# EasyEDA schematic SCH_Clock_2021-09-15.json
TITLE: Clock; REV: 1.0; Date: 2021-09-15; Sheet: 1/1; Drawn By: Ferrie Bank; Company: Oude Snepelaar
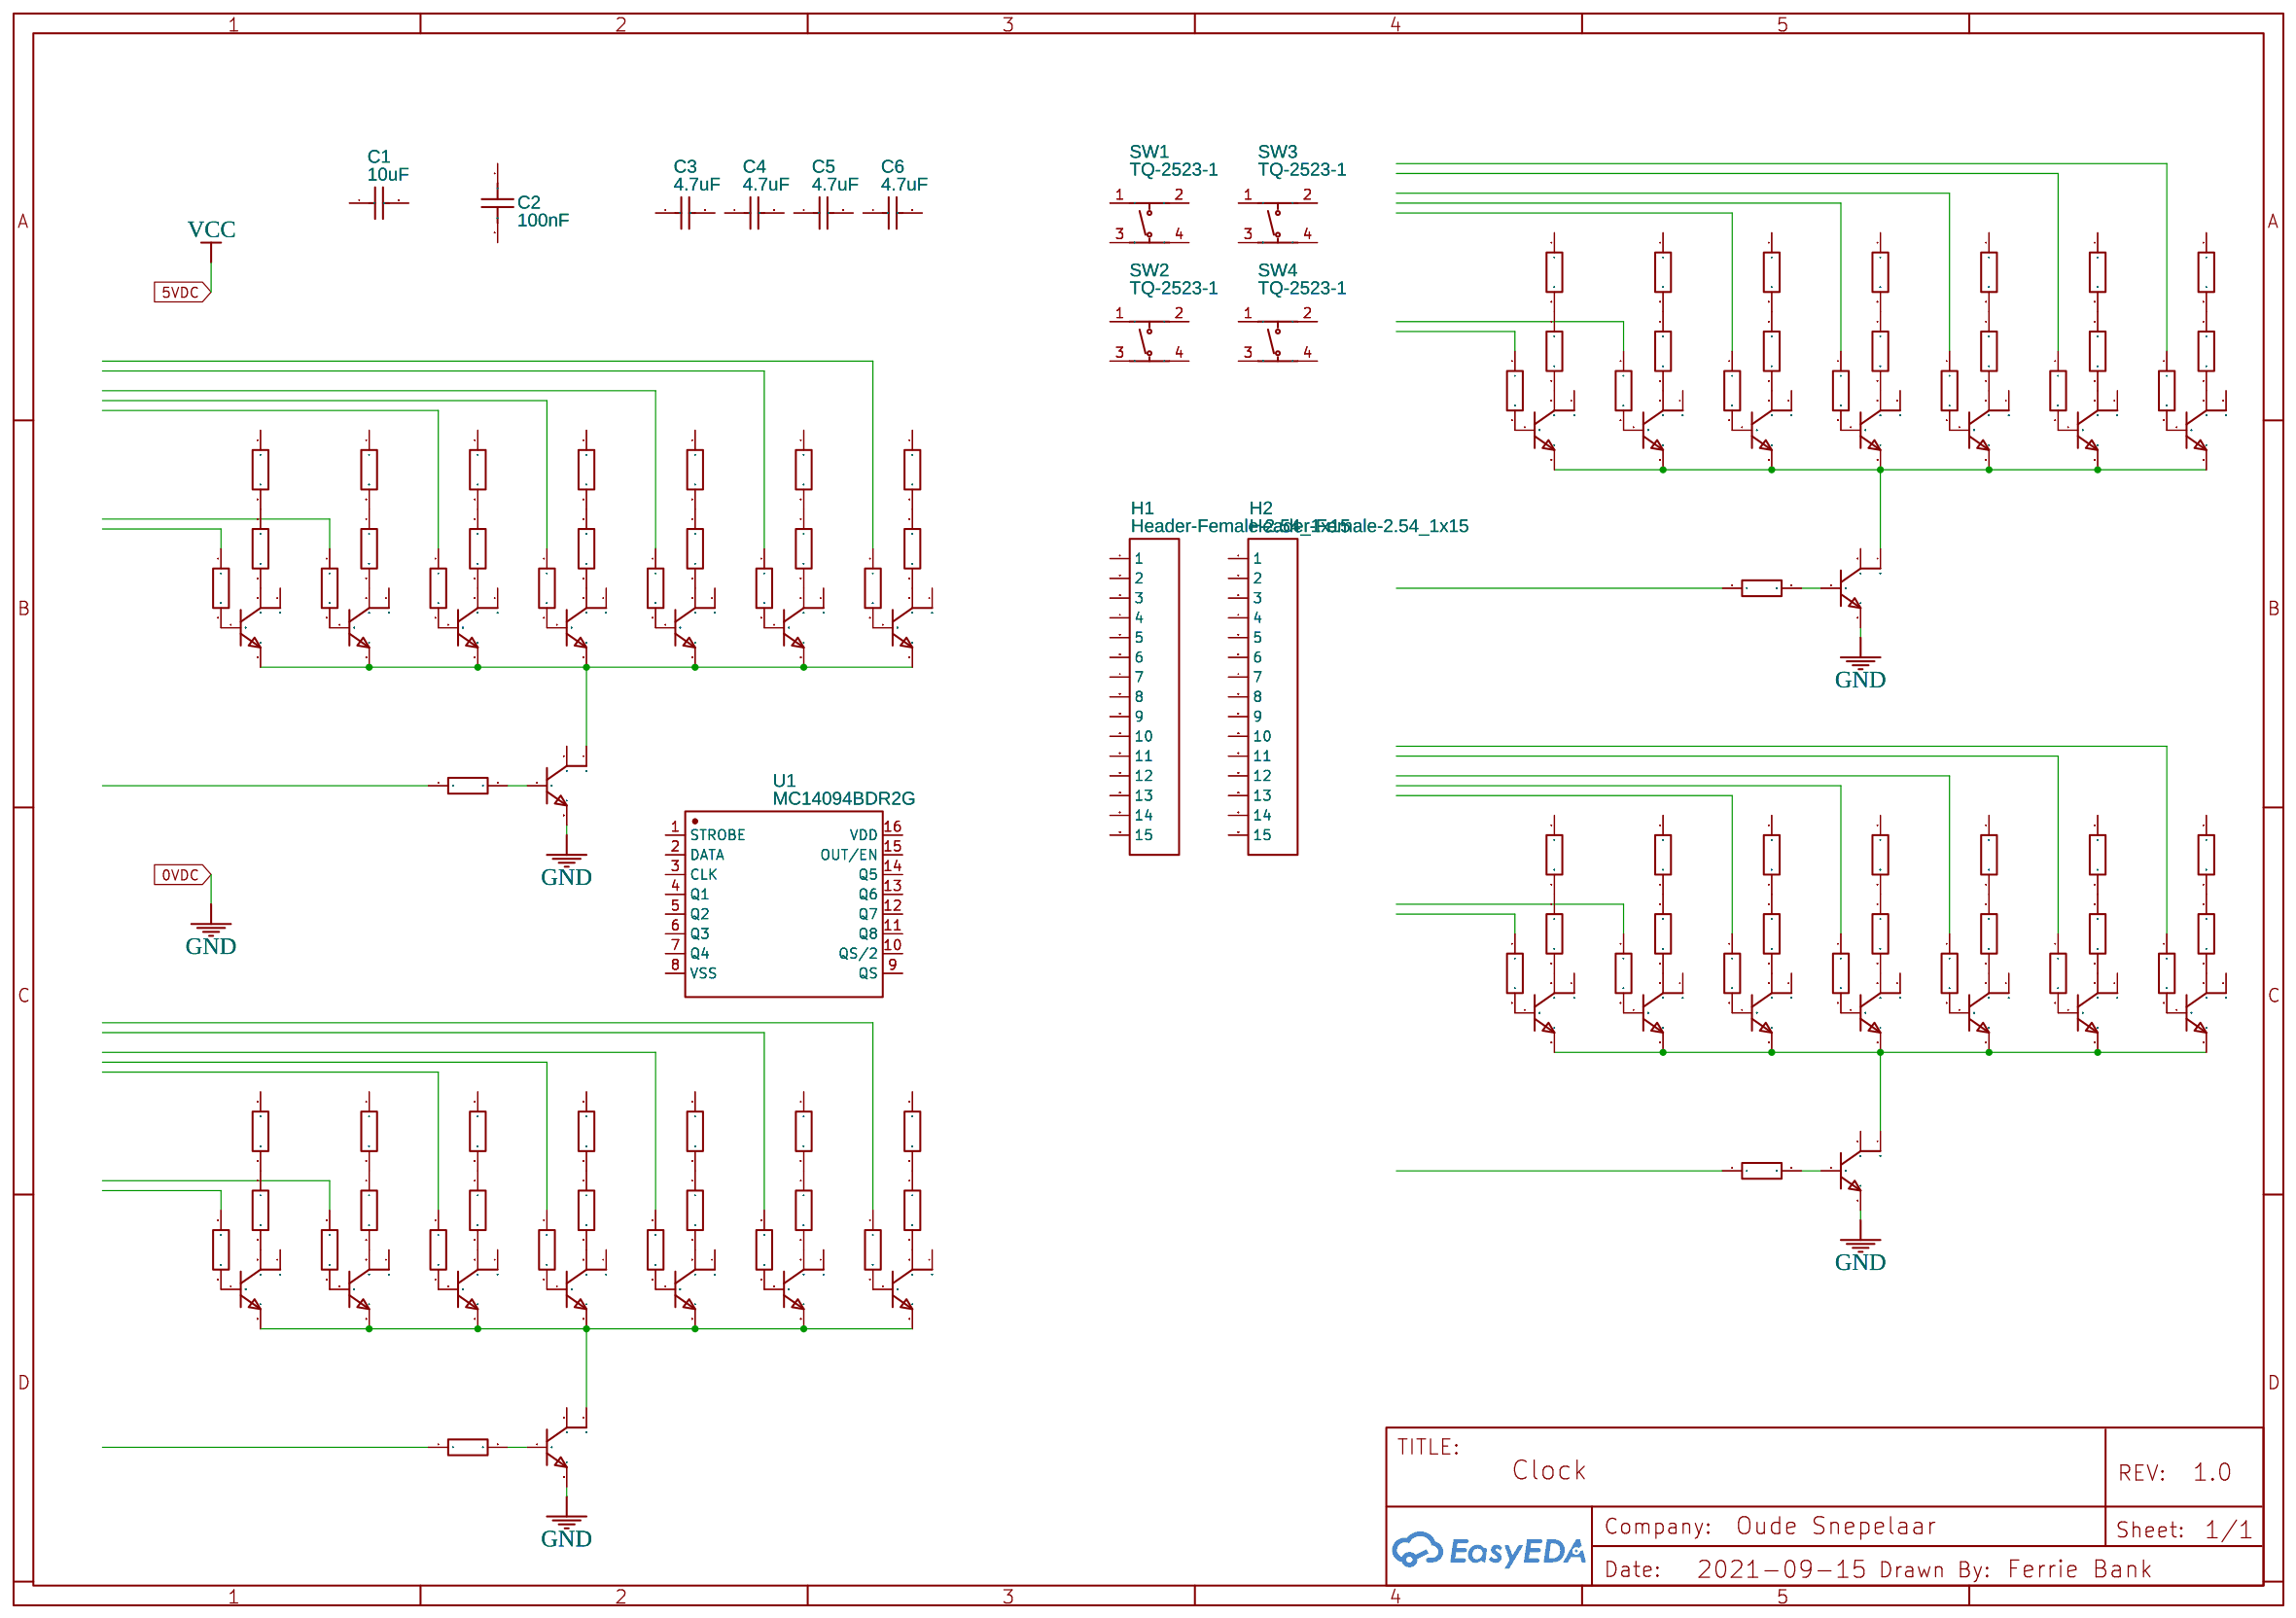
[diagram p0: schematic sheet]

## Parts
C1  10uF  [C0805]
C2  100nF  [C0603]
C3  4.7uF  [C1206]
C4  4.7uF  [C1206]
C5  4.7uF  [C1206]
C6  4.7uF  [C1206]
DGAQ1  PZT2222A  [SOT-223-3_L6.5-W3.4-P2.30-LS7.0-BR]
DGAQ2  PZT2222A  [SOT-223-3_L6.5-W3.4-P2.30-LS7.0-BR]
DGAQ3  PZT2222A  [SOT-223-3_L6.5-W3.4-P2.30-LS7.0-BR]
DGAQ4  PZT2222A  [SOT-223-3_L6.5-W3.4-P2.30-LS7.0-BR]
DGAQ5  PZT2222A  [SOT-223-3_L6.5-W3.4-P2.30-LS7.0-BR]
DGAQ6  PZT2222A  [SOT-223-3_L6.5-W3.4-P2.30-LS7.0-BR]
DGAQ7  PZT2222A  [SOT-223-3_L6.5-W3.4-P2.30-LS7.0-BR]
DGAQ8  PZT2222A  [SOT-223-3_L6.5-W3.4-P2.30-LS7.0-BR]
DGAR1  75  [R0603]
DGAR2  75  [R0603]
DGAR3  75  [R0603]
DGAR4  75  [R0603]
DGAR5  75  [R0603]
DGAR6  75  [R0603]
DGAR7  75  [R0603]
DGAR8  75  [R0603]
DGAR9  75  [R0603]
DGAR10  75  [R0603]
DGAR11  75  [R0603]
DGAR12  75  [R0603]
DGAR13  75  [R0603]
DGAR14  75  [R0603]
DGAR15  33  [R0603]
DGAR16  33  [R0603]
DGAR17  33  [R0603]
DGAR18  33  [R0603]
DGAR19  33  [R0603]
DGAR20  33  [R0603]
DGAR21  33  [R0603]
DGAR22  33  [R0603]
DGBQ1  PZT2222A  [SOT-223-3_L6.5-W3.4-P2.30-LS7.0-BR]
DGBQ2  PZT2222A  [SOT-223-3_L6.5-W3.4-P2.30-LS7.0-BR]
DGBQ3  PZT2222A  [SOT-223-3_L6.5-W3.4-P2.30-LS7.0-BR]
DGBQ4  PZT2222A  [SOT-223-3_L6.5-W3.4-P2.30-LS7.0-BR]
DGBQ5  PZT2222A  [SOT-223-3_L6.5-W3.4-P2.30-LS7.0-BR]
DGBQ6  PZT2222A  [SOT-223-3_L6.5-W3.4-P2.30-LS7.0-BR]
DGBQ7  PZT2222A  [SOT-223-3_L6.5-W3.4-P2.30-LS7.0-BR]
DGBQ8  PZT2222A  [SOT-223-3_L6.5-W3.4-P2.30-LS7.0-BR]
DGBR1  75  [R0603]
DGBR2  75  [R0603]
DGBR3  75  [R0603]
DGBR4  75  [R0603]
DGBR5  75  [R0603]
DGBR6  75  [R0603]
DGBR7  75  [R0603]
DGBR8  75  [R0603]
DGBR9  75  [R0603]
DGBR10  75  [R0603]
DGBR11  75  [R0603]
DGBR12  75  [R0603]
DGBR13  75  [R0603]
DGBR14  75  [R0603]
DGBR15  33  [R0603]
DGBR16  33  [R0603]
DGBR17  33  [R0603]
DGBR18  33  [R0603]
DGBR19  33  [R0603]
DGBR20  33  [R0603]
DGBR21  33  [R0603]
DGBR22  33  [R0603]
DGCQ1  PZT2222A  [SOT-223-3_L6.5-W3.4-P2.30-LS7.0-BR]
DGCQ2  PZT2222A  [SOT-223-3_L6.5-W3.4-P2.30-LS7.0-BR]
DGCQ3  PZT2222A  [SOT-223-3_L6.5-W3.4-P2.30-LS7.0-BR]
DGCQ4  PZT2222A  [SOT-223-3_L6.5-W3.4-P2.30-LS7.0-BR]
DGCQ5  PZT2222A  [SOT-223-3_L6.5-W3.4-P2.30-LS7.0-BR]
DGCQ6  PZT2222A  [SOT-223-3_L6.5-W3.4-P2.30-LS7.0-BR]
DGCQ7  PZT2222A  [SOT-223-3_L6.5-W3.4-P2.30-LS7.0-BR]
DGCQ8  PZT2222A  [SOT-223-3_L6.5-W3.4-P2.30-LS7.0-BR]
DGCR1  75  [R0603]
DGCR2  75  [R0603]
DGCR3  75  [R0603]
DGCR4  75  [R0603]
DGCR5  75  [R0603]
DGCR6  75  [R0603]
DGCR7  75  [R0603]
DGCR8  75  [R0603]
DGCR9  75  [R0603]
DGCR10  75  [R0603]
DGCR11  75  [R0603]
DGCR12  75  [R0603]
DGCR13  75  [R0603]
DGCR14  75  [R0603]
DGCR15  33  [R0603]
DGCR16  33  [R0603]
DGCR17  33  [R0603]
DGCR18  33  [R0603]
DGCR19  33  [R0603]
DGCR20  33  [R0603]
DGCR21  33  [R0603]
DGCR22  33  [R0603]
DGDQ1  PZT2222A  [SOT-223-3_L6.5-W3.4-P2.30-LS7.0-BR]
DGDQ2  PZT2222A  [SOT-223-3_L6.5-W3.4-P2.30-LS7.0-BR]
DGDQ3  PZT2222A  [SOT-223-3_L6.5-W3.4-P2.30-LS7.0-BR]
DGDQ4  PZT2222A  [SOT-223-3_L6.5-W3.4-P2.30-LS7.0-BR]
DGDQ5  PZT2222A  [SOT-223-3_L6.5-W3.4-P2.30-LS7.0-BR]
DGDQ6  PZT2222A  [SOT-223-3_L6.5-W3.4-P2.30-LS7.0-BR]
DGDQ7  PZT2222A  [SOT-223-3_L6.5-W3.4-P2.30-LS7.0-BR]
DGDQ8  PZT2222A  [SOT-223-3_L6.5-W3.4-P2.30-LS7.0-BR]
DGDR1  75  [R0603]
DGDR2  75  [R0603]
DGDR3  75  [R0603]
DGDR4  75  [R0603]
DGDR5  75  [R0603]
DGDR6  75  [R0603]
DGDR7  75  [R0603]
DGDR8  75  [R0603]
DGDR9  75  [R0603]
DGDR10  75  [R0603]
DGDR11  75  [R0603]
DGDR12  75  [R0603]
DGDR13  75  [R0603]
DGDR14  75  [R0603]
DGDR15  33  [R0603]
DGDR16  33  [R0603]
DGDR17  33  [R0603]
DGDR18  33  [R0603]
DGDR19  33  [R0603]
DGDR20  33  [R0603]
DGDR21  33  [R0603]
DGDR22  33  [R0603]
H1  Header-Female-2.54_1x15  [HDR-TH_15P-P2.54-V-F]
H2  Header-Female-2.54_1x15  [HDR-TH_15P-P2.54-V-F]
SW1  TQ-2523-1  [SW-SMD_TQ-2523-1]
SW2  TQ-2523-1  [SW-SMD_TQ-2523-1]
SW3  TQ-2523-1  [SW-SMD_TQ-2523-1]
SW4  TQ-2523-1  [SW-SMD_TQ-2523-1]
U1  MC14094BDR2G  [SOIC-16_L10.8-W4.5-P1.27-LS6.8-BL]

## Library data of the parts
C1 = CL21A106KAYNNNE: Supplier: LCSC; Manufacturer: SAMSUNG; Supplier Part: C15850; JLCPCB Part Class: Basic Part
C2 = CL10B104KB8WPNC: Supplier: LCSC; Supplier Part: C307348; Manufacturer: Samsung Electro-Mechanics; Contributor: LCSC; JLCPCB Part Class: Extended Part
C3-C6 = 1206B475K500NT: Supplier: LCSC; Manufacturer: FH; Supplier Part: C29823; JLCPCB Part Class: Basic Part
DGAQ1-DGAQ8 DGBQ1-DGBQ8 DGCQ1-DGCQ8 DGDQ1-DGDQ8 = PZT2222A: Supplier: LCSC; Supplier Part: C189428; Manufacturer: Changjiang Electronics Tech (CJ); Contributor: LCSC; JLCPCB Part Class: Extended Part
DGAR1-DGAR14 DGBR1-DGBR14 DGCR1-DGCR14 DGDR1-DGDR14 = 0603WAF750JT5E: Supplier: LCSC; Manufacturer: UniOhm; Supplier Part: C4275; JLCPCB Part Class: Basic Part
DGAR15-DGAR22 DGBR15-DGBR22 DGCR15-DGCR22 DGDR15-DGDR22 = 0603WAF330JT5E: Supplier: LCSC; Manufacturer: UniOhm; Supplier Part: C23140; JLCPCB Part Class: Basic Part
H1 H2 = Header-Female-2.54_1x15: Supplier: LCSC; Manufacturer: Ckmtw; Manufacturer Part: 220S-1*15P H=8.5MM Ytype Gold-plated; Supplier Part: C124408; JLCPCB Part Class: Extended Part
SW1-SW4 = TQ-2523-1: Supplier: LCSC; Supplier Part: C669810; Manufacturer: Yuandi; Contributor: LCSC; JLCPCB Part Class: Extended Part
U1 = MC14094BDR2G: Supplier: LCSC; Manufacturer: ON; Contributor: LCSC; Supplier Part: C161627; JLCPCB Part Class: Extended Part

## Nets
0VDC: DGAQ2.3(E) DGBQ2.3(E) DGCQ2.3(E) DGDQ2.3(E)
Net-(DGAQ1-1): DGAQ1.1(B) DGAR16.2
Net-(DGAQ1-2): DGAQ1.2(C) DGAR3.2
Net-(DGAQ1-3): DGAQ1.3(E) DGAQ2.4(C) DGAQ3.3(E) DGAQ4.3(E) DGAQ5.3(E) DGAQ6.3(E) DGAQ7.3(E) DGAQ8.3(E)
Net-(DGAQ2-1): DGAQ2.1(B) DGAR15.2
Net-(DGAQ3-1): DGAQ3.1(B) DGAR22.2
Net-(DGAQ3-2): DGAQ3.2(C) DGAR14.2
Net-(DGAQ4-1): DGAQ4.1(B) DGAR17.2
Net-(DGAQ4-2): DGAQ4.2(C) DGAR4.2
Net-(DGAQ5-1): DGAQ5.1(B) DGAR19.2
Net-(DGAQ5-2): DGAQ5.2(C) DGAR8.2
Net-(DGAQ6-1): DGAQ6.1(B) DGAR18.2
Net-(DGAQ6-2): DGAQ6.2(C) DGAR6.2
Net-(DGAQ7-1): DGAQ7.1(B) DGAR21.2
Net-(DGAQ7-2): DGAQ7.2(C) DGAR12.2
Net-(DGAQ8-1): DGAQ8.1(B) DGAR20.2
Net-(DGAQ8-2): DGAQ8.2(C) DGAR10.2
Net-(DGAR1-2): DGAR1.2 DGAR3.1
Net-(DGAR2-2): DGAR2.2 DGAR4.1
Net-(DGAR5-2): DGAR5.2 DGAR6.1
Net-(DGAR7-2): DGAR7.2 DGAR8.1
Net-(DGAR9-2): DGAR9.2 DGAR10.1
Net-(DGAR11-2): DGAR11.2 DGAR12.1
Net-(DGAR13-2): DGAR13.2 DGAR14.1
Net-(DGBQ1-1): DGBQ1.1(B) DGBR16.2
Net-(DGBQ1-2): DGBQ1.2(C) DGBR3.2
Net-(DGBQ1-3): DGBQ1.3(E) DGBQ2.4(C) DGBQ3.3(E) DGBQ4.3(E) DGBQ5.3(E) DGBQ6.3(E) DGBQ7.3(E) DGBQ8.3(E)
Net-(DGBQ2-1): DGBQ2.1(B) DGBR15.2
Net-(DGBQ3-1): DGBQ3.1(B) DGBR22.2
Net-(DGBQ3-2): DGBQ3.2(C) DGBR14.2
Net-(DGBQ4-1): DGBQ4.1(B) DGBR17.2
Net-(DGBQ4-2): DGBQ4.2(C) DGBR4.2
Net-(DGBQ5-1): DGBQ5.1(B) DGBR19.2
Net-(DGBQ5-2): DGBQ5.2(C) DGBR8.2
Net-(DGBQ6-1): DGBQ6.1(B) DGBR18.2
Net-(DGBQ6-2): DGBQ6.2(C) DGBR6.2
Net-(DGBQ7-1): DGBQ7.1(B) DGBR21.2
Net-(DGBQ7-2): DGBQ7.2(C) DGBR12.2
Net-(DGBQ8-1): DGBQ8.1(B) DGBR20.2
Net-(DGBQ8-2): DGBQ8.2(C) DGBR10.2
Net-(DGBR1-2): DGBR1.2 DGBR3.1
Net-(DGBR2-2): DGBR2.2 DGBR4.1
Net-(DGBR5-2): DGBR5.2 DGBR6.1
Net-(DGBR7-2): DGBR7.2 DGBR8.1
Net-(DGBR9-2): DGBR9.2 DGBR10.1
Net-(DGBR11-2): DGBR11.2 DGBR12.1
Net-(DGBR13-2): DGBR13.2 DGBR14.1
Net-(DGCQ1-1): DGCQ1.1(B) DGCR16.2
Net-(DGCQ1-2): DGCQ1.2(C) DGCR3.2
Net-(DGCQ1-3): DGCQ1.3(E) DGCQ2.4(C) DGCQ3.3(E) DGCQ4.3(E) DGCQ5.3(E) DGCQ6.3(E) DGCQ7.3(E) DGCQ8.3(E)
Net-(DGCQ2-1): DGCQ2.1(B) DGCR15.2
Net-(DGCQ3-1): DGCQ3.1(B) DGCR22.2
Net-(DGCQ3-2): DGCQ3.2(C) DGCR14.2
Net-(DGCQ4-1): DGCQ4.1(B) DGCR17.2
Net-(DGCQ4-2): DGCQ4.2(C) DGCR4.2
Net-(DGCQ5-1): DGCQ5.1(B) DGCR19.2
Net-(DGCQ5-2): DGCQ5.2(C) DGCR8.2
Net-(DGCQ6-1): DGCQ6.1(B) DGCR18.2
Net-(DGCQ6-2): DGCQ6.2(C) DGCR6.2
Net-(DGCQ7-1): DGCQ7.1(B) DGCR21.2
Net-(DGCQ7-2): DGCQ7.2(C) DGCR12.2
Net-(DGCQ8-1): DGCQ8.1(B) DGCR20.2
Net-(DGCQ8-2): DGCQ8.2(C) DGCR10.2
Net-(DGCR1-2): DGCR1.2 DGCR3.1
Net-(DGCR2-2): DGCR2.2 DGCR4.1
Net-(DGCR5-2): DGCR5.2 DGCR6.1
Net-(DGCR7-2): DGCR7.2 DGCR8.1
Net-(DGCR9-2): DGCR9.2 DGCR10.1
Net-(DGCR11-2): DGCR11.2 DGCR12.1
Net-(DGCR13-2): DGCR13.2 DGCR14.1
Net-(DGDQ1-1): DGDQ1.1(B) DGDR16.2
Net-(DGDQ1-2): DGDQ1.2(C) DGDR3.2
Net-(DGDQ1-3): DGDQ1.3(E) DGDQ2.4(C) DGDQ3.3(E) DGDQ4.3(E) DGDQ5.3(E) DGDQ6.3(E) DGDQ7.3(E) DGDQ8.3(E)
Net-(DGDQ2-1): DGDQ2.1(B) DGDR15.2
Net-(DGDQ3-1): DGDQ3.1(B) DGDR22.2
Net-(DGDQ3-2): DGDQ3.2(C) DGDR14.2
Net-(DGDQ4-1): DGDQ4.1(B) DGDR17.2
Net-(DGDQ4-2): DGDQ4.2(C) DGDR4.2
Net-(DGDQ5-1): DGDQ5.1(B) DGDR19.2
Net-(DGDQ5-2): DGDQ5.2(C) DGDR8.2
Net-(DGDQ6-1): DGDQ6.1(B) DGDR18.2
Net-(DGDQ6-2): DGDQ6.2(C) DGDR6.2
Net-(DGDQ7-1): DGDQ7.1(B) DGDR21.2
Net-(DGDQ7-2): DGDQ7.2(C) DGDR12.2
Net-(DGDQ8-1): DGDQ8.1(B) DGDR20.2
Net-(DGDQ8-2): DGDQ8.2(C) DGDR10.2
Net-(DGDR1-2): DGDR1.2 DGDR3.1
Net-(DGDR2-2): DGDR2.2 DGDR4.1
Net-(DGDR5-2): DGDR5.2 DGDR6.1
Net-(DGDR7-2): DGDR7.2 DGDR8.1
Net-(DGDR9-2): DGDR9.2 DGDR10.1
Net-(DGDR11-2): DGDR11.2 DGDR12.1
Net-(DGDR13-2): DGDR13.2 DGDR14.1

Not connected (* = marked no-connect by the designer): C1 1 2; C2 1 2; C3 1 2; C4 1 2; C5 1 2; C6 1 2; DGAQ1 4(C); DGAQ2 2(C); DGAQ3 4(C); DGAQ4 4(C); DGAQ5 4(C); DGAQ6 4(C); DGAQ7 4(C); DGAQ8 4(C); DGAR1 1; DGAR2 1; DGAR5 1; DGAR7 1; DGAR9 1; DGAR11 1; DGAR13 1; DGAR15 1; DGAR16 1; DGAR17 1; DGAR18 1; DGAR19 1; DGAR20 1; DGAR21 1; DGAR22 1; DGBQ1 4(C); DGBQ2 2(C); DGBQ3 4(C); DGBQ4 4(C); DGBQ5 4(C); DGBQ6 4(C); DGBQ7 4(C); DGBQ8 4(C); DGBR1 1; DGBR2 1; DGBR5 1; DGBR7 1; DGBR9 1; DGBR11 1; DGBR13 1; DGBR15 1; DGBR16 1; DGBR17 1; DGBR18 1; DGBR19 1; DGBR20 1; DGBR21 1; DGBR22 1; DGCQ1 4(C); DGCQ2 2(C); DGCQ3 4(C); DGCQ4 4(C); DGCQ5 4(C); DGCQ6 4(C); DGCQ7 4(C); DGCQ8 4(C); DGCR1 1; DGCR2 1; DGCR5 1; DGCR7 1; DGCR9 1; DGCR11 1; DGCR13 1; DGCR15 1; DGCR16 1; DGCR17 1; DGCR18 1; DGCR19 1; DGCR20 1; DGCR21 1; DGCR22 1; DGDQ1 4(C); DGDQ2 2(C); DGDQ3 4(C); DGDQ4 4(C); DGDQ5 4(C); DGDQ6 4(C); DGDQ7 4(C); DGDQ8 4(C); DGDR1 1; DGDR2 1; DGDR5 1; DGDR7 1; DGDR9 1; DGDR11 1; DGDR13 1; DGDR15 1; DGDR16 1; DGDR17 1; DGDR18 1; DGDR19 1; DGDR20 1; DGDR21 1; DGDR22 1; H1 1 2 3 4 5 6 7 8 9 10 11 12 13 14 15; H2 1 2 3 4 5 6 7 8 9 10 11 12 13 14 15; SW1 1 2 3 4; SW2 1 2 3 4; SW3 1 2 3 4; SW4 1 2 3 4; U1 1(STROBE) 2(DATA) 3(CLK) 4(Q1) 5(Q2) 6(Q3) 7(Q4) 8(VSS) 9(QS) 10(QS/2) 11(Q8) 12(Q7) 13(Q6) 14(Q5) 15(OUT/EN) 16(VDD)
